# Altium schematic sheet FaultOptoNO.SchDoc
size Letter; Organization: Altium Limited; Address1: L3, 12a Rodborough Rd; Address2: Frenchs Forest; Address3: NSW; Address4: Australia 2086; DocumentNumber: D_10; SheetNumber: 10; SheetTotal: 21
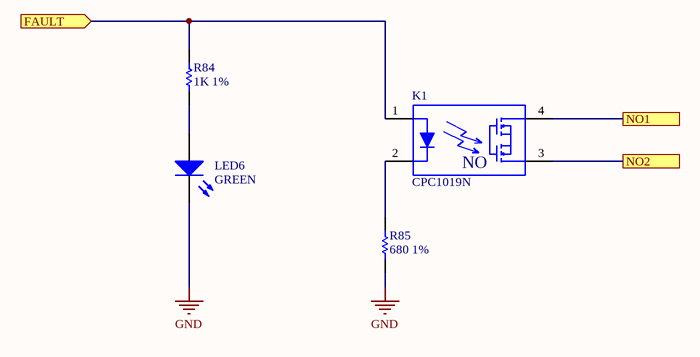
[diagram p0: FaultOptoNO.SchDoc]

## Parts
K1  CPC1019N  [SOP254P610X206-4N]
LED6  GREEN  [LED0805]
R84  1K 1%  [R0805]
R85  680 1%  [R0805]

## Ports
FAULT (in), NO1, NO2

## Nets
GND: LED6.1(K) R85.1
FAULT: K1.1 R84.1 ; port FAULT
NO1: K1.4 ; port NO1
NO2: K1.3 ; port NO2
NetK1_2: K1.2 R85.2
NetLED6_2: LED6.2(A) R84.2

## Notes on the sheet
- Title
- Size:
- Date:
- Letter
- Number:
- Time:
- Revision:
- Sheet
- of
- Fluid Power Training
- Institute Inc.
- 2170 S 3040 W
- Salt Lake City, 84119,UT.
- United States.
- File:
- (in symbol CPC1019N) NO

## Library data of the parts
K1 = CPC1019N: Relay SSR 50mA 1.4V DC-IN 0.75A 60V AC-OUT 4-Pin SOP Tube; Manufacturer: Ixys Clare; Output Current: 750mA; Throw Configuration: SPST; Isolation Voltage: 1.5kV; Supplier 1: Mouser; Supplier Part Number 1: 849-CPC1019N; Manufacturer Part Number: CPC1019N; RoHS: Yes; Category: Solid State Relays; Stock 1: 6539; Pricing 1: 1=1.76000, 10=1.61000, 20=1.47000, 50=1.41000, 100=1.34000, 200=1.19000 (USD); Mount: Surface Mount; Case/Package: SOP; Number of Pins: 4; Min Operating Temperature: -40°C; Max Operating Temperature: 85°C; Packaging: Rail/Tube; Package Quantity: 100; Termination: Gull Wing; Max Output Voltage: 60V; Input Current: 50mA; Length: 4.089mm; Height: 2.184mm; Width: 3.8mm; Radiation Hardening: No; ComponentLink1URL: http://components.arrow.com/part/dataview/0323_06647336?src-supplier=Arrow+Europe; ComponentLink1Description: http://components.arrow.com/part/dataview/0323_06647336?src-supplier=Arrow+Europe; ComponentLink2URL: http://www.mouser.com/ds/2/205/CPC1019N-594134.pdf?src-supplier=Mouser; ComponentLink2Description: http://www.mouser.com/ds/2/205/CPC1019N-594134.pdf?src-supplier=Mouser; ComponentLink3URL: http://components.arrow.com/part/dataview/47904908S477565N2018?src-supplier=Arrow; ComponentLink3Description: http://components.arrow.com/part/dataview/47904908S477565N2018?src-supplier=Arrow; ComponentLink4URL: http://www.ixysic.com/home/pdfs.nsf/www/CPC1019N.pdf/$file/CPC1019N.pdf?src-supplier=Digi-Key; ComponentLink4Description: http://www.ixysic.com/home/pdfs.nsf/www/CPC1019N.pdf/$file/CPC1019N.pdf?src-supplier=Digi-Key
LED6 = 150080VS75000: LED GREEN CLEAR 0805 SMD; Manufacturer: Wurth Electronics; Viewing Angle: 140°; Lens Style: Clear,Rectangular; Forward Voltage: 2V; Luminous Intensity: 40mcd; Dominant Wavelength: 570nm; Forward Current: 30mA; Test Current: 20mA; Supplier 1: Mouser; Supplier Part Number 1: 710-150080VS75000; Manufacturer Part Number: 150080VS75000; RoHS: Yes; Category: LEDs; Stock 1: 16574; Pricing 1: 1=0.18000, 10=0.17500, 25=0.17400, 50=0.16200, 100=0.13900, 250=0.12300 (USD); Mount: Surface Mount; Case/Package: 0805; Color: Green; Case Code (Metric): 2012; Case Code (Imperial): 0805; Min Operating Temperature: -40°C; Max Operating Temperature: 85°C; Packaging: Tape and Reel; Package Quantity: 4000; Wavelength: 570nm; Length: 2mm; Height: 0.7mm; Width: 1.25mm; REACH SVHC: Unknown; ComponentLink1URL: https://datasheet.ciiva.com/22656/150080vs75000-22656966.pdf?src-supplier=Element14; ComponentLink1Description: https://datasheet.ciiva.com/22656/150080vs75000-22656966.pdf?src-supplier=Element14; ComponentLink2URL: https://datasheet.ciiva.com/29279/759437-da-01-en-chipled-0805-w-kl-h-gruen-150080vs7500-29279047.pdf?src-supplier=Conrad; ComponentLink2Description: https://datasheet.ciiva.com/29279/759437-da-01-en-chipled-0805-w-kl-h-gruen-150080vs7500-29279047.pdf?src-supplier=Conrad; ComponentLink3URL: https://datasheet.ciiva.com/29563/150080vs75000-29563018.pdf?src-supplier=Digi-Key; ComponentLink3Description: https://datasheet.ciiva.com/29563/150080vs75000-29563018.pdf?src-supplier=Digi-Key
R84 = RC0805FR-071KL: RESISTOR, 0805 1K 1%, FULL REEL; Product Range:YAGEO - RC Series; Resistance:1kohm; Power Rating:125mW; Resistance Tolerance:± 1%; Resistor Case Style:0805 [2012 Metric]; Resistor Element Material:Thick Film; Temperature Coefficient:± 250ppm/°C; Voltage Rating:150V; Packaging:Tape & Reel; MSL:-; SVHC:No SVHC (16-Dec-2013); External Depth:0.55mm; External Length / Height:2mm; External Width:1.25mm; No. of Pins:2; Operating Temperature Max:155°C; Operating Temperature Min:-55°C; Operating Temperature Range:-55°C to +155°C; Reel Quantity:5000; Resistor Mounting:SMD; Series:RC12H; Temperature Coef; Manufacturer: Yageo; Resistance: 1kR; Temperature Coefficient: 100ppm/°C; Power Rating: 125mW; Voltage Rating: 150V; Supplier 1: Mouser; Manufacturer Part Number: RC0805FR-071KL; RoHS: Yes; Stock 1: 1519412; Pricing 1: 1=0.13000, 10=0.03100, 100=0.01100, 1000=0.00800, 5000=0.00500, 10000=0.00500 (USD); ComponentLink1URL: https://datasheet.ciiva.com/2456/pyu-r-int-thick-7-2456976.pdf?src-supplier=Digi-Key; ComponentLink1Description: https://datasheet.ciiva.com/2456/pyu-r-int-thick-7-2456976.pdf?src-supplier=Digi-Key; ComponentLink2URL: https://datasheet.ciiva.com/2456/pyu-r-int-thick-7-2456977.pdf?src-supplier=Digi-Key; ComponentLink2Description: https://datasheet.ciiva.com/2456/pyu-r-int-thick-7-2456977.pdf?src-supplier=Digi-Key; Supplier Part Number 1: 603-RC0805FR-071KL; Category: Chip SMD Resistors; Case/Package: 0805; Case Code (Imperial): 0805; Case Code (Metric): 2012; Min Operating Temperature: -55°C; Max Operating Temperature: 155°C; Tolerance: 1%; Packaging: Tape and Reel; Composition: Thick Film; Termination: SMD/SMT; Voltage Rating (DC): 150V; Package Quantity: 1; Military Standard: Not; Length: 0.079inch; Height: 0.024inch; Width: 0.049inch; Depth: 1.25mm; Lead Free: Lead Free; REACH SVHC: Unknown; ComponentLink3URL: https://datasheet.ciiva.com/7941/1686128-7941719.pdf?src-supplier=Element14; ComponentLink3Description: https://datasheet.ciiva.com/7941/1686128-7941719.pdf?src-supplier=Element14; ComponentLink4URL: https://datasheet.ciiva.com/16850/rc0805-16850409.pdf?src-supplier=Future+Electronics; ComponentLink4Description: https://datasheet.ciiva.com/16850/rc0805-16850409.pdf?src-supplier=Future+Electronics; ComponentLink5URL: https://datasheet.ciiva.com/46385/444164-46385020.pdf?src-supplier=Element14; ComponentLink5Description: https://datasheet.ciiva.com/46385/444164-46385020.pdf?src-supplier=Element14; ComponentLink6URL: https://datasheet.ciiva.com/2456/pyu-r-int-thick-7-2456975.pdf?src-supplier=Digi-Key; ComponentLink6Description: https://datasheet.ciiva.com/2456/pyu-r-int-thick-7-2456975.pdf?src-supplier=Digi-Key; Number of Pins: 2; Number of Terminations: 2; Max Power Dissipation: 125mW; Features: Moisture Resistant
R85 = ERJ6ENF6800V: 680 ohm, 125 mW,  1%, 150 V,PANASONIC ELECTRONIC COMPONENTS         ERJ6ENF6800V            Surface Mount Chip Resistor, Thick Film, AEC-Q200 ERJ6E Series,; Resistance: 680R; Temperature Coefficient: 100ppm/°C; Power Rating: 125mW; Voltage Rating: 150V; Supplier 1: Mouser; Supplier Part Number 1: 667-ERJ-6ENF6800V; Manufacturer: Panasonic; Manufacturer Part Number: ERJ6ENF6800V; RoHS: Yes; Category: Chip SMD Resistors; Stock 1: 59996; Pricing 1: 1=0.11000, 10=0.07200, 100=0.02800, 1000=0.01900, 5000=0.01700, 10000=0.01500 (USD); Mount: Surface Mount; Case/Package: 0805; Number of Pins: 2; Case Code (Metric): 2012; Case Code (Imperial): 0805; Contact Plating: Tin; Min Operating Temperature: -55°C; Max Operating Temperature: 155°C; Packaging: Tape and Reel; Tolerance: 1%; Composition: Thick Film; Termination: SMD/SMT; Number of Terminations: 2; Max Power Dissipation: 125mW; Package Quantity: 1; Features: Automotive AEC-Q200; Military Standard: Not; Length: 2mm; Height: 0.6mm; Width: 0.049inch; Depth: 1.25mm; Radiation Hardening: No; REACH SVHC: No SVHC; ComponentLink1URL: https://datasheet.ciiva.com/11821/0900766b80f80784-11821688.pdf?src-supplier=RSComponents; ComponentLink1Description: https://datasheet.ciiva.com/11821/0900766b80f80784-11821688.pdf?src-supplier=RSComponents; ComponentLink2URL: https://datasheet.ciiva.com/16787/70260748-16787589.pdf?src-supplier=Allied+Electronics; ComponentLink2Description: https://datasheet.ciiva.com/16787/70260748-16787589.pdf?src-supplier=Allied+Electronics; ComponentLink3URL: https://datasheet.ciiva.com/9180/aoa0000ce2-9180429.pdf?src-supplier=Avnet; ComponentLink3Description: https://datasheet.ciiva.com/9180/aoa0000ce2-9180429.pdf?src-supplier=Avnet; ComponentLink4URL: https://datasheet.ciiva.com/7944/426256-7944661.pdf?src-supplier=Element14; ComponentLink4Description: https://datasheet.ciiva.com/7944/426256-7944661.pdf?src-supplier=Element14; ComponentLink5URL: https://datasheet.ciiva.com/16512/aoa0000ce2-16512058.pdf?src-supplier=Avnet+Asia; ComponentLink5Description: https://datasheet.ciiva.com/16512/aoa0000ce2-16512058.pdf?src-supplier=Avnet+Asia; ComponentLink6URL: https://datasheet.ciiva.com/16757/70260748-16757933.pdf?src-supplier=Allied+Electronics; ComponentLink6Description: https://datasheet.ciiva.com/16757/70260748-16757933.pdf?src-supplier=Allied+Electronics; ComponentLink7URL: https://datasheet.ciiva.com/30107/aoa0000ce2-30107005.pdf?src-supplier=Onlinecomponents.com; ComponentLink7Description: https://datasheet.ciiva.com/30107/aoa0000ce2-30107005.pdf?src-supplier=Onlinecomponents.com; ComponentLink8URL: https://datasheet.ciiva.com/46373/1678782-46373887.pdf?src-supplier=Element14; ComponentLink8Description: https://datasheet.ciiva.com/46373/1678782-46373887.pdf?src-supplier=Element14; ComponentLink9URL: https://datasheet.ciiva.com/17205/aoa0000ce2-17205287.pdf?src-supplier=Avnet+Europe; ComponentLink9Description: https://datasheet.ciiva.com/17205/aoa0000ce2-17205287.pdf?src-supplier=Avnet+Europe; ComponentLink10URL: https://datasheet.ciiva.com/7944/426256-7944953.pdf?src-supplier=Element14; ComponentLink10Description: https://datasheet.ciiva.com/7944/426256-7944953.pdf?src-supplier=Element14; ComponentLink11URL: https://datasheet.ciiva.com/5860/426256-5860698.pdf?src-supplier=Farnell; ComponentLink11Description: https://datasheet.ciiva.com/5860/426256-5860698.pdf?src-supplier=Farnell; ComponentLink12URL: https://datasheet.ciiva.com/46373/1678782-46373886.pdf?src-supplier=Element14; ComponentLink12Description: https://datasheet.ciiva.com/46373/1678782-46373886.pdf?src-supplier=Element14